# Altium schematic sheet [08] - POWER CONTROL AND DISTRIBUTION.SchDoc
size A2; DocumentNumber: 8; SheetNumber: 8; SheetTotal: 12; PageSetup: Record=PageOptions|CenterHorizontal=True|CenterVertical=True|PrintScale=0.73|XCorrection=1.00|YCorrection=1.00|PrintKind=0|BorderSize=5000000|LeftOffset=0|BottomOffset=0|Orientation=2|PaperLength=1000|PaperWidth=1000|Scale=100|PaperSource=7|PrintQuality=-3|MediaType=1|DitherType=10|PrintScaleMode=1|PaperKind=A3|PaperIndex=8
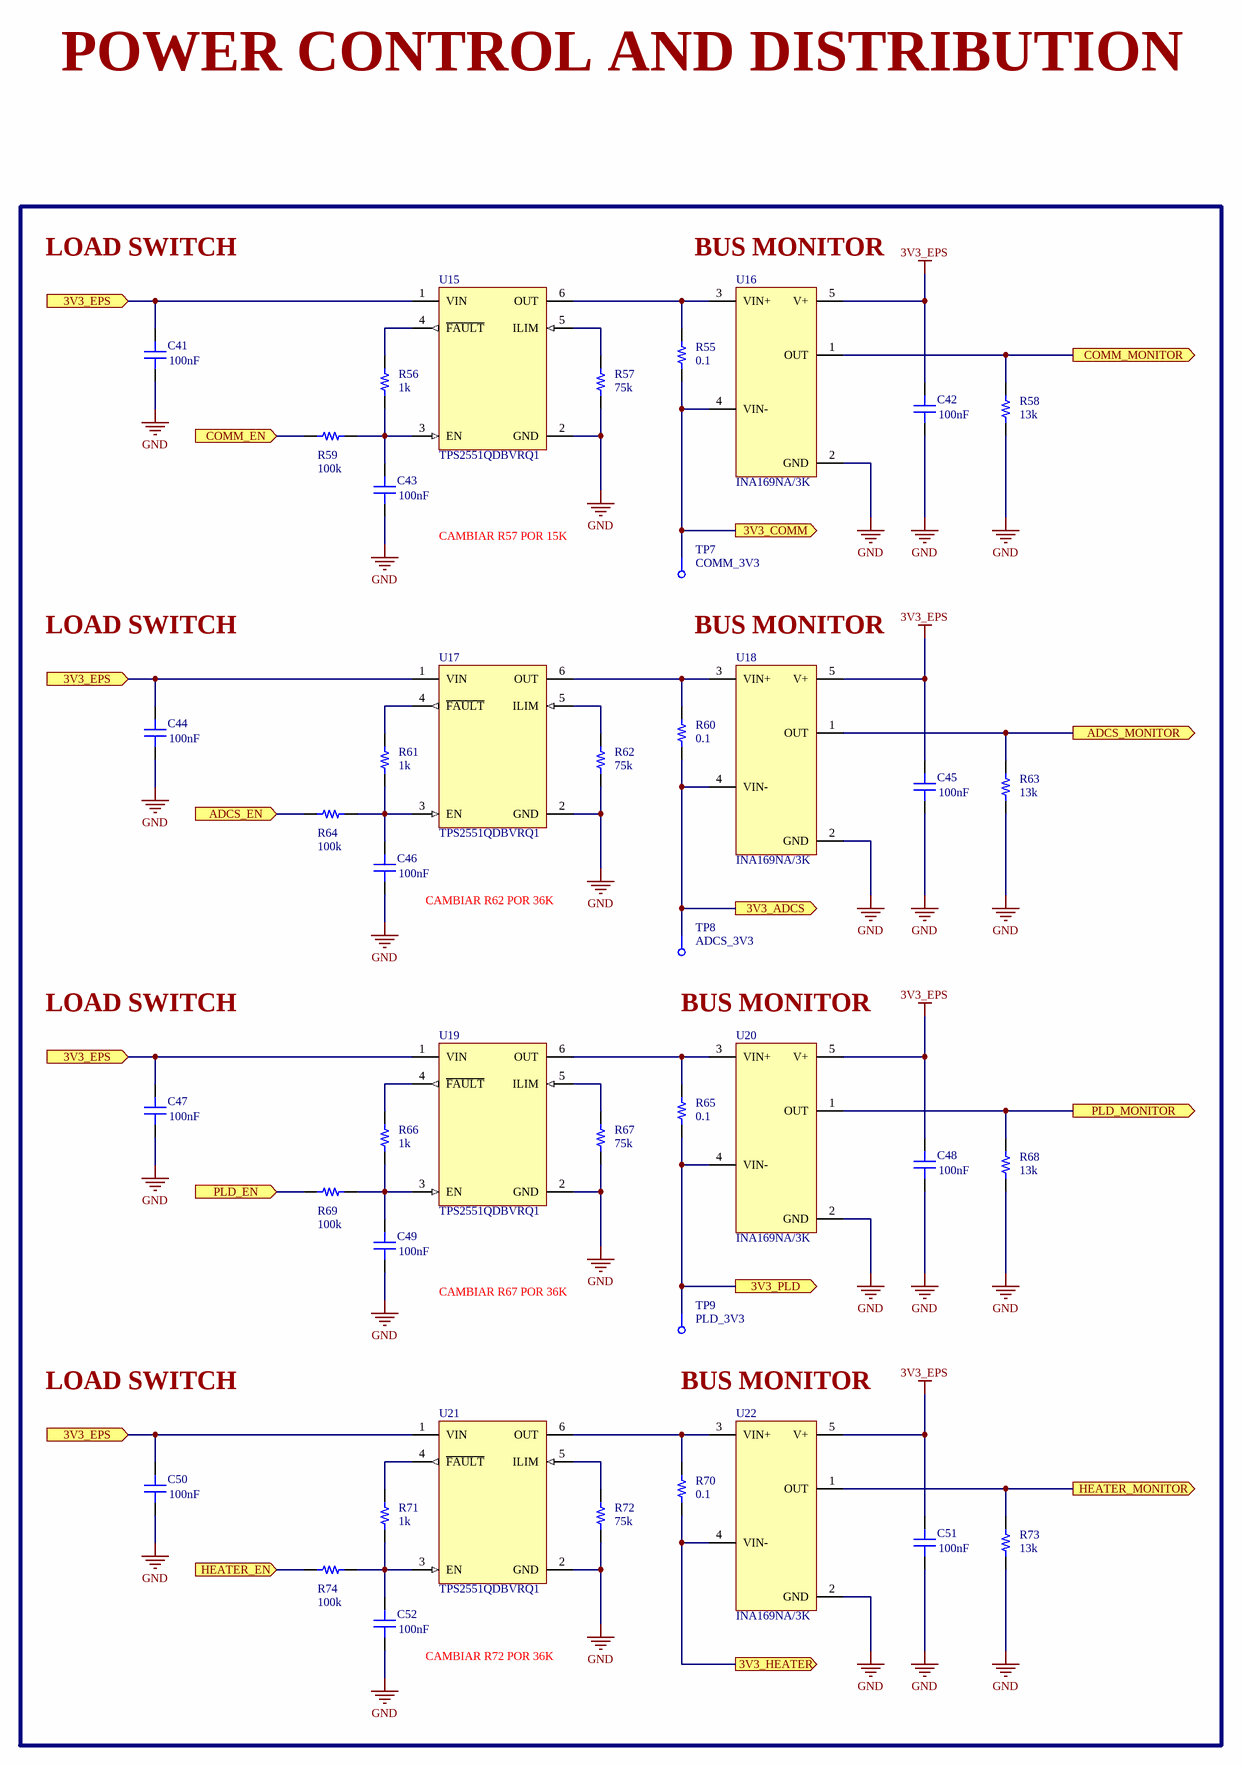
[diagram p0: [08] - POWER CONTROL AND DISTRIBUTION.SchDoc]

## Parts
C41  Capacitance: 100nF  [CAP 0603/1608]  (hidden comment: C0603C104K8RACTU)
C42  Capacitance: 100nF  [CAP 0603/1608]  (hidden comment: C0603C104K8RACTU)
C43  Capacitance: 100nF  [CAP 0603/1608]  (hidden comment: C0603C104K8RACTU)
C44  Capacitance: 100nF  [CAP 0603/1608]  (hidden comment: C0603C104K8RACTU)
C45  Capacitance: 100nF  [CAP 0603/1608]  (hidden comment: C0603C104K8RACTU)
C46  Capacitance: 100nF  [CAP 0603/1608]  (hidden comment: C0603C104K8RACTU)
C47  Capacitance: 100nF  [CAP 0603/1608]  (hidden comment: C0603C104K8RACTU)
C48  Capacitance: 100nF  [CAP 0603/1608]  (hidden comment: C0603C104K8RACTU)
C49  Capacitance: 100nF  [CAP 0603/1608]  (hidden comment: C0603C104K8RACTU)
C50  Capacitance: 100nF  [CAP 0603/1608]  (hidden comment: C0603C104K8RACTU)
C51  Capacitance: 100nF  [CAP 0603/1608]  (hidden comment: C0603C104K8RACTU)
C52  Capacitance: 100nF  [CAP 0603/1608]  (hidden comment: C0603C104K8RACTU)
R55  Resistance: 0.1  [RES 0603/1608]  (hidden comment: RU1608FR100CS)
R56  Resistance: 1k  [RES 0603/1608]  (hidden comment: ESR03EZPJ102)
R57  Resistance: 75k  [RES 0603/1608]  (hidden comment: ERJ3EKF7502V)
R58  Resistance: 13k  [RES 0603/1608]  (hidden comment: RC0603JR-0713KL)
R59  Resistance: 100k  [RES 0603/1608]  (hidden comment: CR0603-JW-104ELF)
R60  Resistance: 0.1  [RES 0603/1608]  (hidden comment: RU1608FR100CS)
R61  Resistance: 1k  [RES 0603/1608]  (hidden comment: ESR03EZPJ102)
R62  Resistance: 75k  [RES 0603/1608]  (hidden comment: ERJ3EKF7502V)
R63  Resistance: 13k  [RES 0603/1608]  (hidden comment: RC0603JR-0713KL)
R64  Resistance: 100k  [RES 0603/1608]  (hidden comment: CR0603-JW-104ELF)
R65  Resistance: 0.1  [RES 0603/1608]  (hidden comment: RU1608FR100CS)
R66  Resistance: 1k  [RES 0603/1608]  (hidden comment: ESR03EZPJ102)
R67  Resistance: 75k  [RES 0603/1608]  (hidden comment: ERJ3EKF7502V)
R68  Resistance: 13k  [RES 0603/1608]  (hidden comment: RC0603JR-0713KL)
R69  Resistance: 100k  [RES 0603/1608]  (hidden comment: CR0603-JW-104ELF)
R70  Resistance: 0.1  [RES 0603/1608]  (hidden comment: RU1608FR100CS)
R71  Resistance: 1k  [RES 0603/1608]  (hidden comment: ESR03EZPJ102)
R72  Resistance: 75k  [RES 0603/1608]  (hidden comment: ERJ3EKF7502V)
R73  Resistance: 13k  [RES 0603/1608]  (hidden comment: RC0603JR-0713KL)
R74  Resistance: 100k  [RES 0603/1608]  (hidden comment: CR0603-JW-104ELF)
TP7  COMM_3V3  [Testpoint]
TP8  ADCS_3V3  [Testpoint]
TP9  PLD_3V3  [Testpoint]
U15  TPS2551QDBVRQ1  [SOT23-6]
U16  INA169NA/3K  [SOT95P245X110-5N]
U17  TPS2551QDBVRQ1  [SOT23-6]
U18  INA169NA/3K  [SOT95P245X110-5N]
U19  TPS2551QDBVRQ1  [SOT23-6]
U20  INA169NA/3K  [SOT95P245X110-5N]
U21  TPS2551QDBVRQ1  [SOT23-6]
U22  INA169NA/3K  [SOT95P245X110-5N]

## Ports
3V3_ADCS (out), 3V3_COMM (out), 3V3_EPS (in), 3V3_HEATER (out), 3V3_PLD (out), ADCS_EN (in), ADCS_MONITOR (out), COMM_EN (in), COMM_MONITOR (out), HEATER_EN (in), HEATER_MONITOR (out), PLD_EN (in), PLD_MONITOR (out)

## Nets
3V3_EPS: C42.2 C45.2 C48.2 C51.2 U16.5(V+) U18.5(V+) U20.5(V+) U22.5(V+)
GND: C41.1 C42.1 C43.1 C44.1 C45.1 C46.1 C47.1 C48.1 C49.1 C50.1 C51.1 C52.1 R57.1 R58.1 R62.1 R63.1 R67.1 R68.1 R72.1 R73.1 U15.2(GND) U16.2(GND) U17.2(GND) U18.2(GND) U19.2(GND) U20.2(GND) U21.2(GND) U22.2(GND)
3V3_ADCS: R60.2 TP8.1 U18.4(VIN-) ; port 3V3_ADCS
3V3_COMM: R55.2 TP7.1 U16.4(VIN-) ; port 3V3_COMM
3V3_EPS: C41.2 C44.2 C47.2 C50.2 U15.1(VIN) U17.1(VIN) U19.1(VIN) U21.1(VIN) ; port 3V3_EPS  [a separate net that carries the same name]
3V3_HEATER: R70.2 U22.4(VIN-) ; port 3V3_HEATER
3V3_PLD: R65.2 TP9.1 U20.4(VIN-) ; port 3V3_PLD
ADCS_EN: R64.1 ; port ADCS_EN
ADCS_MONITOR: R63.2 U18.1(OUT) ; port ADCS_MONITOR
COMM_EN: R59.1 ; port COMM_EN
COMM_MONITOR: R58.2 U16.1(OUT) ; port COMM_MONITOR
HEATER_EN: R74.1 ; port HEATER_EN
HEATER_MONITOR: R73.2 U22.1(OUT) ; port HEATER_MONITOR
PLD_EN: R69.1 ; port PLD_EN
PLD_MONITOR: R68.2 U20.1(OUT) ; port PLD_MONITOR
NetC43_2: C43.2 R56.1 R59.2 U15.3(EN)
NetC46_2: C46.2 R61.1 R64.2 U17.3(EN)
NetC49_2: C49.2 R66.1 R69.2 U19.3(EN)
NetC52_2: C52.2 R71.1 R74.2 U21.3(EN)
NetR55_1: R55.1 U15.6(OUT) U16.3(VIN+)
NetR56_2: R56.2 U15.4(~{FAULT})
NetR57_2: R57.2 U15.5(ILIM)
NetR60_1: R60.1 U17.6(OUT) U18.3(VIN+)
NetR61_2: R61.2 U17.4(~{FAULT})
NetR62_2: R62.2 U17.5(ILIM)
NetR65_1: R65.1 U19.6(OUT) U20.3(VIN+)
NetR66_2: R66.2 U19.4(~{FAULT})
NetR67_2: R67.2 U19.5(ILIM)
NetR70_1: R70.1 U21.6(OUT) U22.3(VIN+)
NetR71_2: R71.2 U21.4(~{FAULT})
NetR72_2: R72.2 U21.5(ILIM)

## Notes on the sheet
- POWER CONTROL AND DISTRIBUTION
- LOAD SWITCH
- (near U16) BUS MONITOR
- CAMBIAR R57 POR 15K
- BUS MONITOR
- (near C46) CAMBIAR R62 POR 36K
- CAMBIAR R67 POR 36K
- (near C52) CAMBIAR R72 POR 36K
- Project:
- Page Contents:
- Size:
- Revision:
- A2
- Document Number:
- Design:
- Date:
- Sheet
- of

## Library data of the parts
C41-C52 = C0603C104K8RACTU: CAP CER 0.1UF 10V X7R 0603; Manufacturer: KEMET; Dielectric Material: Ceramic; Tolerance: 10%; Dissipation Factor: 5%; Supplier 1: Digi-Key; Manufacturer Part Number: C0603C104K8RACTU; Stock 1: 778651; Pricing 1: 1=0.15, 10=0.107, 100=0.0504, 500=0.03536, 1000=0.02927 (USD); Mount: Surface Mount,PCB; Case/Package: 0603; Number of Pins: 2; Case Code (Imperial): 0603; Case Code (Metric): 1608; Contact Plating: Tin,Matte; Min Operating Temperature: -55°C; Max Operating Temperature: 125°C; Voltage Rating: 10V; Packaging: Tape and Reel; Package Quantity: 1; Voltage Rating (DC): 10V; Dielectric: X7R; Termination: SMD/SMT; Voltage: 10V; Length: 1.6mm; Height: 0.8mm; Width: 0.8mm; Lead Pitch: 0.7mm; Thickness: 0.034inch; Depth: 0.8mm; Radiation Hardening: No; REACH SVHC: No SVHC; ComponentLink1URL: http://www.farnell.com/datasheets/2315110.pdf?src-supplier=Farnell; ComponentLink1Description: http://www.farnell.com/datasheets/2315110.pdf?src-supplier=Farnell; ComponentLink2URL: http://www.kemet.com/kemet/web/homepage/kechome.nsf/vapubfiles/KEM_C1002_X7R_SMD.pdf/$file/KEM_C1002_X7R_SMD.pdf?src-supplier=Element14; ComponentLink2Description: http://www.kemet.com/kemet/web/homepage/kechome.nsf/vapubfiles/KEM_C1002_X7R_SMD.pdf/$file/KEM_C1002_X7R_SMD.pdf?src-supplier=Element14; ComponentLink3URL: https://www.verical.com/server-webapp/html/getDatasheet?partID=91529&src-supplier=Verical; ComponentLink3Description: https://www.verical.com/server-webapp/html/getDatasheet?partID=91529&src-supplier=Verical; ComponentLink4URL: http://www.mouser.com/ds/2/212/KEM_C1002_X7R_SMD-1102033.pdf?src-supplier=Mouser; ComponentLink4Description: http://www.mouser.com/ds/2/212/KEM_C1002_X7R_SMD-1102033.pdf?src-supplier=Mouser; ComponentLink5URL: http://www.alliedelec.com/m/d/9bfe7773041ffe9d406e68bc7b377fdd.pdf?src-supplier=Allied+Electronics; ComponentLink5Description: http://www.alliedelec.com/m/d/9bfe7773041ffe9d406e68bc7b377fdd.pdf?src-supplier=Allied+Electronics; ComponentLink6URL: http://www.farnell.com/datasheets/1851736.pdf?src-supplier=Element14; ComponentLink6Description: http://www.farnell.com/datasheets/1851736.pdf?src-supplier=Element14; Supplier Part Number 1: 399-1095-1-ND
R55 R60 R65 R70 = RU1608FR100CS: RES SMD 0.1 OHM 1% 1/4W 0603; Manufacturer: Samsung; Max Power Dissipation: 250mW; Temperature Coefficient: 150ppm/°C; Supplier 1: Digi-Key; Manufacturer Part Number: RU1608FR100CS; Stock 1: 163209; Pricing 1: 1 = 0.38000, 10 = 0.27300, 25 = 0.20160, 50 = 0.14860, 100 = 0.10910, 250 = 0.09012, 500 = 0.07432, 1000 = 0.05376 (USD); RoHS: Yes; Case/Package: 0603; Case Code (Metric): 1608; Case Code (Imperial): 0603; Min Operating Temperature: -55°C; Max Operating Temperature: 155°C; Packaging: Tape and Reel; Tolerance: 1%; Composition: Thick Film; Number of Terminations: 2; Features: Moisture Resistant; Length: 0.063inch; Height: 0.022inch; Width: 0.031inch; Lead Free: Lead Free; ComponentLink1URL: https://datasheet.ciiva.com/26126/chip-resistor-150112-1-26126821.pdf?src-supplier=Digi-Key; ComponentLink1Description: https://datasheet.ciiva.com/26126/chip-resistor-150112-1-26126821.pdf?src-supplier=Digi-Key; Supplier Part Number 1: 1276-6155-1-ND
R56 R61 R66 R71 = ESR03EZPJ102: RES SMD 1K OHM 5% 1/4W 0603; Manufacturer: Rohm; Temperature Coefficient: 200ppm/°C; Max Power Dissipation: 250mW; Supplier 1: Digi-Key; Manufacturer Part Number: ESR03EZPJ102; Stock 1: 187581; Pricing 1: 1 = 0.10000, 10 = 0.08300, 100 = 0.03180, 1000 = 0.01398, 2500 = 0.01207 (USD); RoHS: Yes; Case/Package: 0603; Case Code (Metric): 1608; Case Code (Imperial): 0603; Min Operating Temperature: -55°C; Max Operating Temperature: 155°C; Tolerance: 5%; Package Quantity: 1; Packaging: Tape and Reel; Composition: Thick Film; Number of Terminations: 2; Features: Automotive AEC-Q200; Length: 0.063inch; Height: 0.022inch; Width: 0.031inch; Lead Free: Lead Free; ComponentLink1URL: https://datasheet.ciiva.com/2469/esr-2469603.pdf?src-supplier=Digi-Key; ComponentLink1Description: https://datasheet.ciiva.com/2469/esr-2469603.pdf?src-supplier=Digi-Key; ComponentLink2URL: https://datasheet.ciiva.com/2469/esr-2469604.pdf?src-supplier=Digi-Key; ComponentLink2Description: https://datasheet.ciiva.com/2469/esr-2469604.pdf?src-supplier=Digi-Key; ComponentLink3URL: https://datasheet.ciiva.com/2469/esr-2469605.pdf?src-supplier=Digi-Key; ComponentLink3Description: https://datasheet.ciiva.com/2469/esr-2469605.pdf?src-supplier=Digi-Key; Supplier Part Number 1: RHM1.0KDCT-ND
R57 R62 R67 R72 = ERJ3EKF7502V: RES SMD 75K OHM 1% 1/10W 0603; Manufacturer: Panasonic; Power Rating: 100mW; Voltage Rating: 75V; Temperature Coefficient: 100ppm/°C; Voltage Rating (DC): 50V; Supplier 1: Digi-Key; Manufacturer Part Number: ERJ3EKF7502V; Stock 1: 1035475; Pricing 1: 1 = 0.10000, 10 = 0.06500, 100 = 0.02640, 1000 = 0.01186, 2500 = 0.01029 (USD); RoHS: Yes; Mount: Surface Mount; Case/Package: 0603; Case Code (Metric): 1608; Case Code (Imperial): 0603; Contact Plating: Tin; Min Operating Temperature: -55°C; Max Operating Temperature: 155°C; Tolerance: 1%; Packaging: Tape and Reel; Package Quantity: 1; Composition: Thick Film; Number of Terminations: 2; Termination: SMD/SMT; Military Standard: Not; Max Power Dissipation: 100mW; Features: Automotive AEC-Q200; Length: 1.6mm; Height: 0.45mm; Width: 0.031inch; Depth: 0.8mm; Radiation Hardening: No; REACH SVHC: No SVHC; Lead Free: Lead Free; ComponentLink1URL: https://datasheet.ciiva.com/34303/1988401-34303605.pdf?src-supplier=Jameco; ComponentLink1Description: https://datasheet.ciiva.com/34303/1988401-34303605.pdf?src-supplier=Jameco; ComponentLink2URL: https://datasheet.ciiva.com/24069/aoa0000ce2-24069064.pdf?src-supplier=Mouser; ComponentLink2Description: https://datasheet.ciiva.com/24069/aoa0000ce2-24069064.pdf?src-supplier=Mouser; ComponentLink3URL: https://datasheet.ciiva.com/28596/1678782-28596232.pdf?src-supplier=Element14; ComponentLink3Description: https://datasheet.ciiva.com/28596/1678782-28596232.pdf?src-supplier=Element14; ComponentLink4URL: https://datasheet.ciiva.com/15159/getdatasheetpartid-28812-15159210.pdf?src-supplier=Verical; ComponentLink4Description: https://datasheet.ciiva.com/15159/getdatasheetpartid-28812-15159210.pdf?src-supplier=Verical; ComponentLink5URL: https://datasheet.ciiva.com/31835/aoa0000ce2-31835674.pdf?src-supplier=Onlinecomponents.com; ComponentLink5Description: https://datasheet.ciiva.com/31835/aoa0000ce2-31835674.pdf?src-supplier=Onlinecomponents.com; ComponentLink6URL: https://datasheet.ciiva.com/28676/1678782-28676971.pdf?src-supplier=Element14; ComponentLink6Description: https://datasheet.ciiva.com/28676/1678782-28676971.pdf?src-supplier=Element14; ComponentLink7URL: https://datasheet.ciiva.com/46374/426256-46374235.pdf?src-supplier=Element14; ComponentLink7Description: https://datasheet.ciiva.com/46374/426256-46374235.pdf?src-supplier=Element14; ComponentLink8URL: https://datasheet.ciiva.com/48531/aoa0000ce2-48531550.pdf?src-supplier=Avnet; ComponentLink8Description: https://datasheet.ciiva.com/48531/aoa0000ce2-48531550.pdf?src-supplier=Avnet; ComponentLink9URL: https://datasheet.ciiva.com/9187/aoa0000ce2-9187719.pdf?src-supplier=Avnet; ComponentLink9Description: https://datasheet.ciiva.com/9187/aoa0000ce2-9187719.pdf?src-supplier=Avnet; Supplier Part Number 1: P75.0KHCT-ND
R58 R63 R68 R73 = RC0603JR-0713KL: RES SMD 13K OHM 5% 1/10W 0603; Manufacturer: Yageo; Power Rating: 100mW; Voltage Rating: 75V; Temperature Coefficient: 100ppm/°C; Voltage Rating (DC): 50V; Supplier 1: Digi-Key; Manufacturer Part Number: RC0603JR-0713KL; Stock 1: 370235; Pricing 1: 1 = 0.10000, 10 = 0.02000, 100 = 0.00810, 1000 = 0.00362, 2500 = 0.00314 (USD); RoHS: Yes; Case/Package: 0603; Weight: 7.1E-05oz; Case Code (Imperial): 0603; Case Code (Metric): 1608; Contact Plating: Tin; Min Operating Temperature: -55°C; Max Operating Temperature: 155°C; Tolerance: 5%; Packaging: Tape and Reel; Termination: SMD/SMT; Composition: Thick Film; Military Standard: Not; Length: 1.6mm; Height: 0.45mm; Width: 0.8mm; Depth: 0.8mm; Radiation Hardening: No; Lead Free: Lead Free; ComponentLink1URL: https://datasheet.ciiva.com/8890/pyu-rc0603-51-rohs-l-4-8890984.pdf?src-supplier=Avnet; ComponentLink1Description: https://datasheet.ciiva.com/8890/pyu-rc0603-51-rohs-l-4-8890984.pdf?src-supplier=Avnet; ComponentLink2URL: https://datasheet.ciiva.com/12577/rc0603-272842-12577401.pdf?src-supplier=Mouser; ComponentLink2Description: https://datasheet.ciiva.com/12577/rc0603-272842-12577401.pdf?src-supplier=Mouser; Supplier Part Number 1: 311-13KGRCT-ND
R59 R64 R69 R74 = CR0603-JW-104ELF: RES SMD 100K OHM 5% 1/10W 0603; Manufacturer: Bourns; Power Rating: 100mW; Voltage Rating: 50V; Temperature Coefficient: 200ppm/°C; Supplier 1: Digi-Key; Manufacturer Part Number: CR0603-JW-104ELF; Stock 1: 138181; Pricing 1: 1 = 0.10000, 10 = 0.01500, 25 = 0.01080, 50 = 0.00840, 100 = 0.00610, 250 = 0.00468, 500 = 0.00374, 1000 = 0.00275 (USD); RoHS: Yes; Mount: Surface Mount; Case/Package: 0603; Number of Pins: 2; Case Code (Imperial): 0603; Case Code (Metric): 1608; Contact Plating: Tin; Min Operating Temperature: -55°C; Max Operating Temperature: 155°C; Packaging: Tape and Reel; Tolerance: 5%; Package Quantity: 5000; Composition: Thick Film; Termination: SMD/SMT; Working Voltage: 50V; Military Standard: Not; Voltage Rating (DC): 50V; Length: 1.6mm; Height: 0.45mm; Width: 0.8mm; Depth: 0.8mm; Thickness: 457um; Radiation Hardening: No; REACH SVHC: No SVHC; ComponentLink1URL: https://datasheet.ciiva.com/22713/691949-22713239.pdf?src-supplier=Element14; ComponentLink1Description: https://datasheet.ciiva.com/22713/691949-22713239.pdf?src-supplier=Element14; ComponentLink2URL: https://datasheet.ciiva.com/23776/1902866-23776391.pdf?src-supplier=Newark; ComponentLink2Description: https://datasheet.ciiva.com/23776/1902866-23776391.pdf?src-supplier=Newark; ComponentLink3URL: https://datasheet.ciiva.com/16766/70154685-16766760.pdf?src-supplier=Allied+Electronics; ComponentLink3Description: https://datasheet.ciiva.com/16766/70154685-16766760.pdf?src-supplier=Allied+Electronics; ComponentLink4URL: https://datasheet.ciiva.com/30229/159chpreztr-30229129.pdf?src-supplier=Onlinecomponents.com; ComponentLink4Description: https://datasheet.ciiva.com/30229/159chpreztr-30229129.pdf?src-supplier=Onlinecomponents.com; ComponentLink5URL: https://datasheet.ciiva.com/16935/chpreztr-16935963.pdf?src-supplier=Avnet+Europe; ComponentLink5Description: https://datasheet.ciiva.com/16935/chpreztr-16935963.pdf?src-supplier=Avnet+Europe; ComponentLink6URL: https://datasheet.ciiva.com/5543/chpreztr-5543676.pdf?src-supplier=Mouser; ComponentLink6Description: https://datasheet.ciiva.com/5543/chpreztr-5543676.pdf?src-supplier=Mouser; ComponentLink7URL: https://datasheet.ciiva.com/9120/chpreztr-9120764.pdf?src-supplier=Avnet; ComponentLink7Description: https://datasheet.ciiva.com/9120/chpreztr-9120764.pdf?src-supplier=Avnet; ComponentLink8URL: https://datasheet.ciiva.com/46383/1791942-46383790.pdf?src-supplier=Element14; ComponentLink8Description: https://datasheet.ciiva.com/46383/1791942-46383790.pdf?src-supplier=Element14; ComponentLink9URL: https://datasheet.ciiva.com/48692/001055501-da-01-en-smd-wid-cr0603-jw-104elf-100k-ohm-1-10w-48692133.pdf?src-supplier=Conrad; ComponentLink9Description: https://datasheet.ciiva.com/48692/001055501-da-01-en-smd-wid-cr0603-jw-104elf-100k-ohm-1-10w-48692133.pdf?src-supplier=Conrad; Supplier Part Number 1: CR0603-JW-104ELFCT-ND
TP7-TP9 = Testpoint: GENERIC TESTPOINT
U15 U17 U19 U21 = TPS2551QDBVRQ1: IC POWER-DIST SWITCH ADJ SOT23-6; Manufacturer: Texas Instruments; Min Supply Voltage: 2.5V; Max Supply Voltage: 6.5V; Max Power Dissipation: 625mW; Number of Outputs: 1; Output Current: 0pA; Interface: Serial; Max Input Voltage: 5.5V; Min Input Voltage: 4.5V; On-State Resistance: 85mR; Supplier 1: Digi-Key; Manufacturer Part Number: TPS2551QDBVRQ1; Stock 1: 5882; Pricing 1: 1 = 2.69000, 10 = 2.41700, 100 = 1.98040, 500 = 1.68586, 1000 = 1.42181 (USD); RoHS: Yes; Case/Package: SOT-23-6; Number of Pins: 6; Min Operating Temperature: -40°C; Max Operating Temperature: 125°C; Package Quantity: 3000; Packaging: Tape and Reel; Power Dissipation: 625mW; Radiation Hardening: No; REACH SVHC: No SVHC; Lead Free: Lead Free; ComponentLink1URL: https://datasheet.ciiva.com/1962/tps2551-q1-1962640.pdf?src-supplier=Digi-Key; ComponentLink1Description: https://datasheet.ciiva.com/1962/tps2551-q1-1962640.pdf?src-supplier=Digi-Key; ComponentLink2URL: https://datasheet.ciiva.com/4924/slvs850-120518-4924547.pdf?src-supplier=Mouser; ComponentLink2Description: https://datasheet.ciiva.com/4924/slvs850-120518-4924547.pdf?src-supplier=Mouser; ComponentLink3URL: https://datasheet.ciiva.com/3233/tps2551-q1-3233588.pdf?src-supplier=Avnet; ComponentLink3Description: https://datasheet.ciiva.com/3233/tps2551-q1-3233588.pdf?src-supplier=Avnet; ComponentLink4URL: https://datasheet.ciiva.com/15109/getdatasheetpartid-329852-15109046.pdf?src-supplier=Verical; ComponentLink4Description: https://datasheet.ciiva.com/15109/getdatasheetpartid-329852-15109046.pdf?src-supplier=Verical; ComponentLink5URL: https://datasheet.ciiva.com/15258/slvs850-15258699.pdf?src-supplier=Arrow+Europe; ComponentLink5Description: https://datasheet.ciiva.com/15258/slvs850-15258699.pdf?src-supplier=Arrow+Europe; ComponentLink6URL: https://datasheet.ciiva.com/1962/tps2551-q1-1962641.pdf?src-supplier=Digi-Key; ComponentLink6Description: https://datasheet.ciiva.com/1962/tps2551-q1-1962641.pdf?src-supplier=Digi-Key; ComponentLink7URL: https://datasheet.ciiva.com/1962/tps2551-q1-1962642.pdf?src-supplier=Digi-Key; ComponentLink7Description: https://datasheet.ciiva.com/1962/tps2551-q1-1962642.pdf?src-supplier=Digi-Key; Supplier Part Number 1: 296-23692-1-ND
U16 U18 U20 U22 = INA169NA/3K: IC CURRENT MONITOR 0.5% SOT23-5; Manufacturer: Texas Instruments; Nominal Supply Current: 125uA; Min Supply Voltage: 2.7V; Max Supply Voltage: 60V; Common Mode Rejection Ratio: 100dB; Number of Channels: 1; Input Bias Current: 10uA; Input Offset Voltage (Vos): 1mV; Bandwidth: 440kHz; Supplier 1: Digi-Key; Manufacturer Part Number: INA169NA/3K; Stock 1: 23056; Pricing 1: 1=2.27, 10=2.042, 100=1.641, 500=1.34828, 1000=1.11714 (USD); Mount: Surface Mount; Case/Package: SOT-23; Number of Pins: 5; Weight: 0.000617oz; Min Operating Temperature: -40°C; Max Operating Temperature: 125°C; Packaging: Tape and Reel; Package Quantity: 3000; Number of Elements: 1; Number of Amplifiers: 1; Accuracy: 0.5%; Radiation Hardening: No; REACH SVHC: No SVHC; Lead Free: Lead Free; ComponentLink1URL: http://www.ti.com/general/docs/lit/getliterature.tsp?genericPartNumber=INA169&&fileType=pdf; ComponentLink1Description: http://www.ti.com/general/docs/lit/getliterature.tsp?genericPartNumber=INA169&&fileType=pdf; ComponentLink2URL: https://www.verical.com/server-webapp/html/getDatasheet?partID=243276; ComponentLink2Description: https://www.verical.com/server-webapp/html/getDatasheet?partID=243276; ComponentLink3URL: http://www.ti.com/lit/ds/symlink/ina139.pdf; ComponentLink3Description: http://www.ti.com/lit/ds/symlink/ina139.pdf; ComponentLink4URL: http://www.ti.com/lit/ds/sbos181d/sbos181d.pdf; ComponentLink4Description: http://www.ti.com/lit/ds/sbos181d/sbos181d.pdf; Supplier Part Number 1: 296-26063-6-ND